# EasyEDA Pro project 2022-4T-MNT-4.eprj

# Schematic EDA4.2
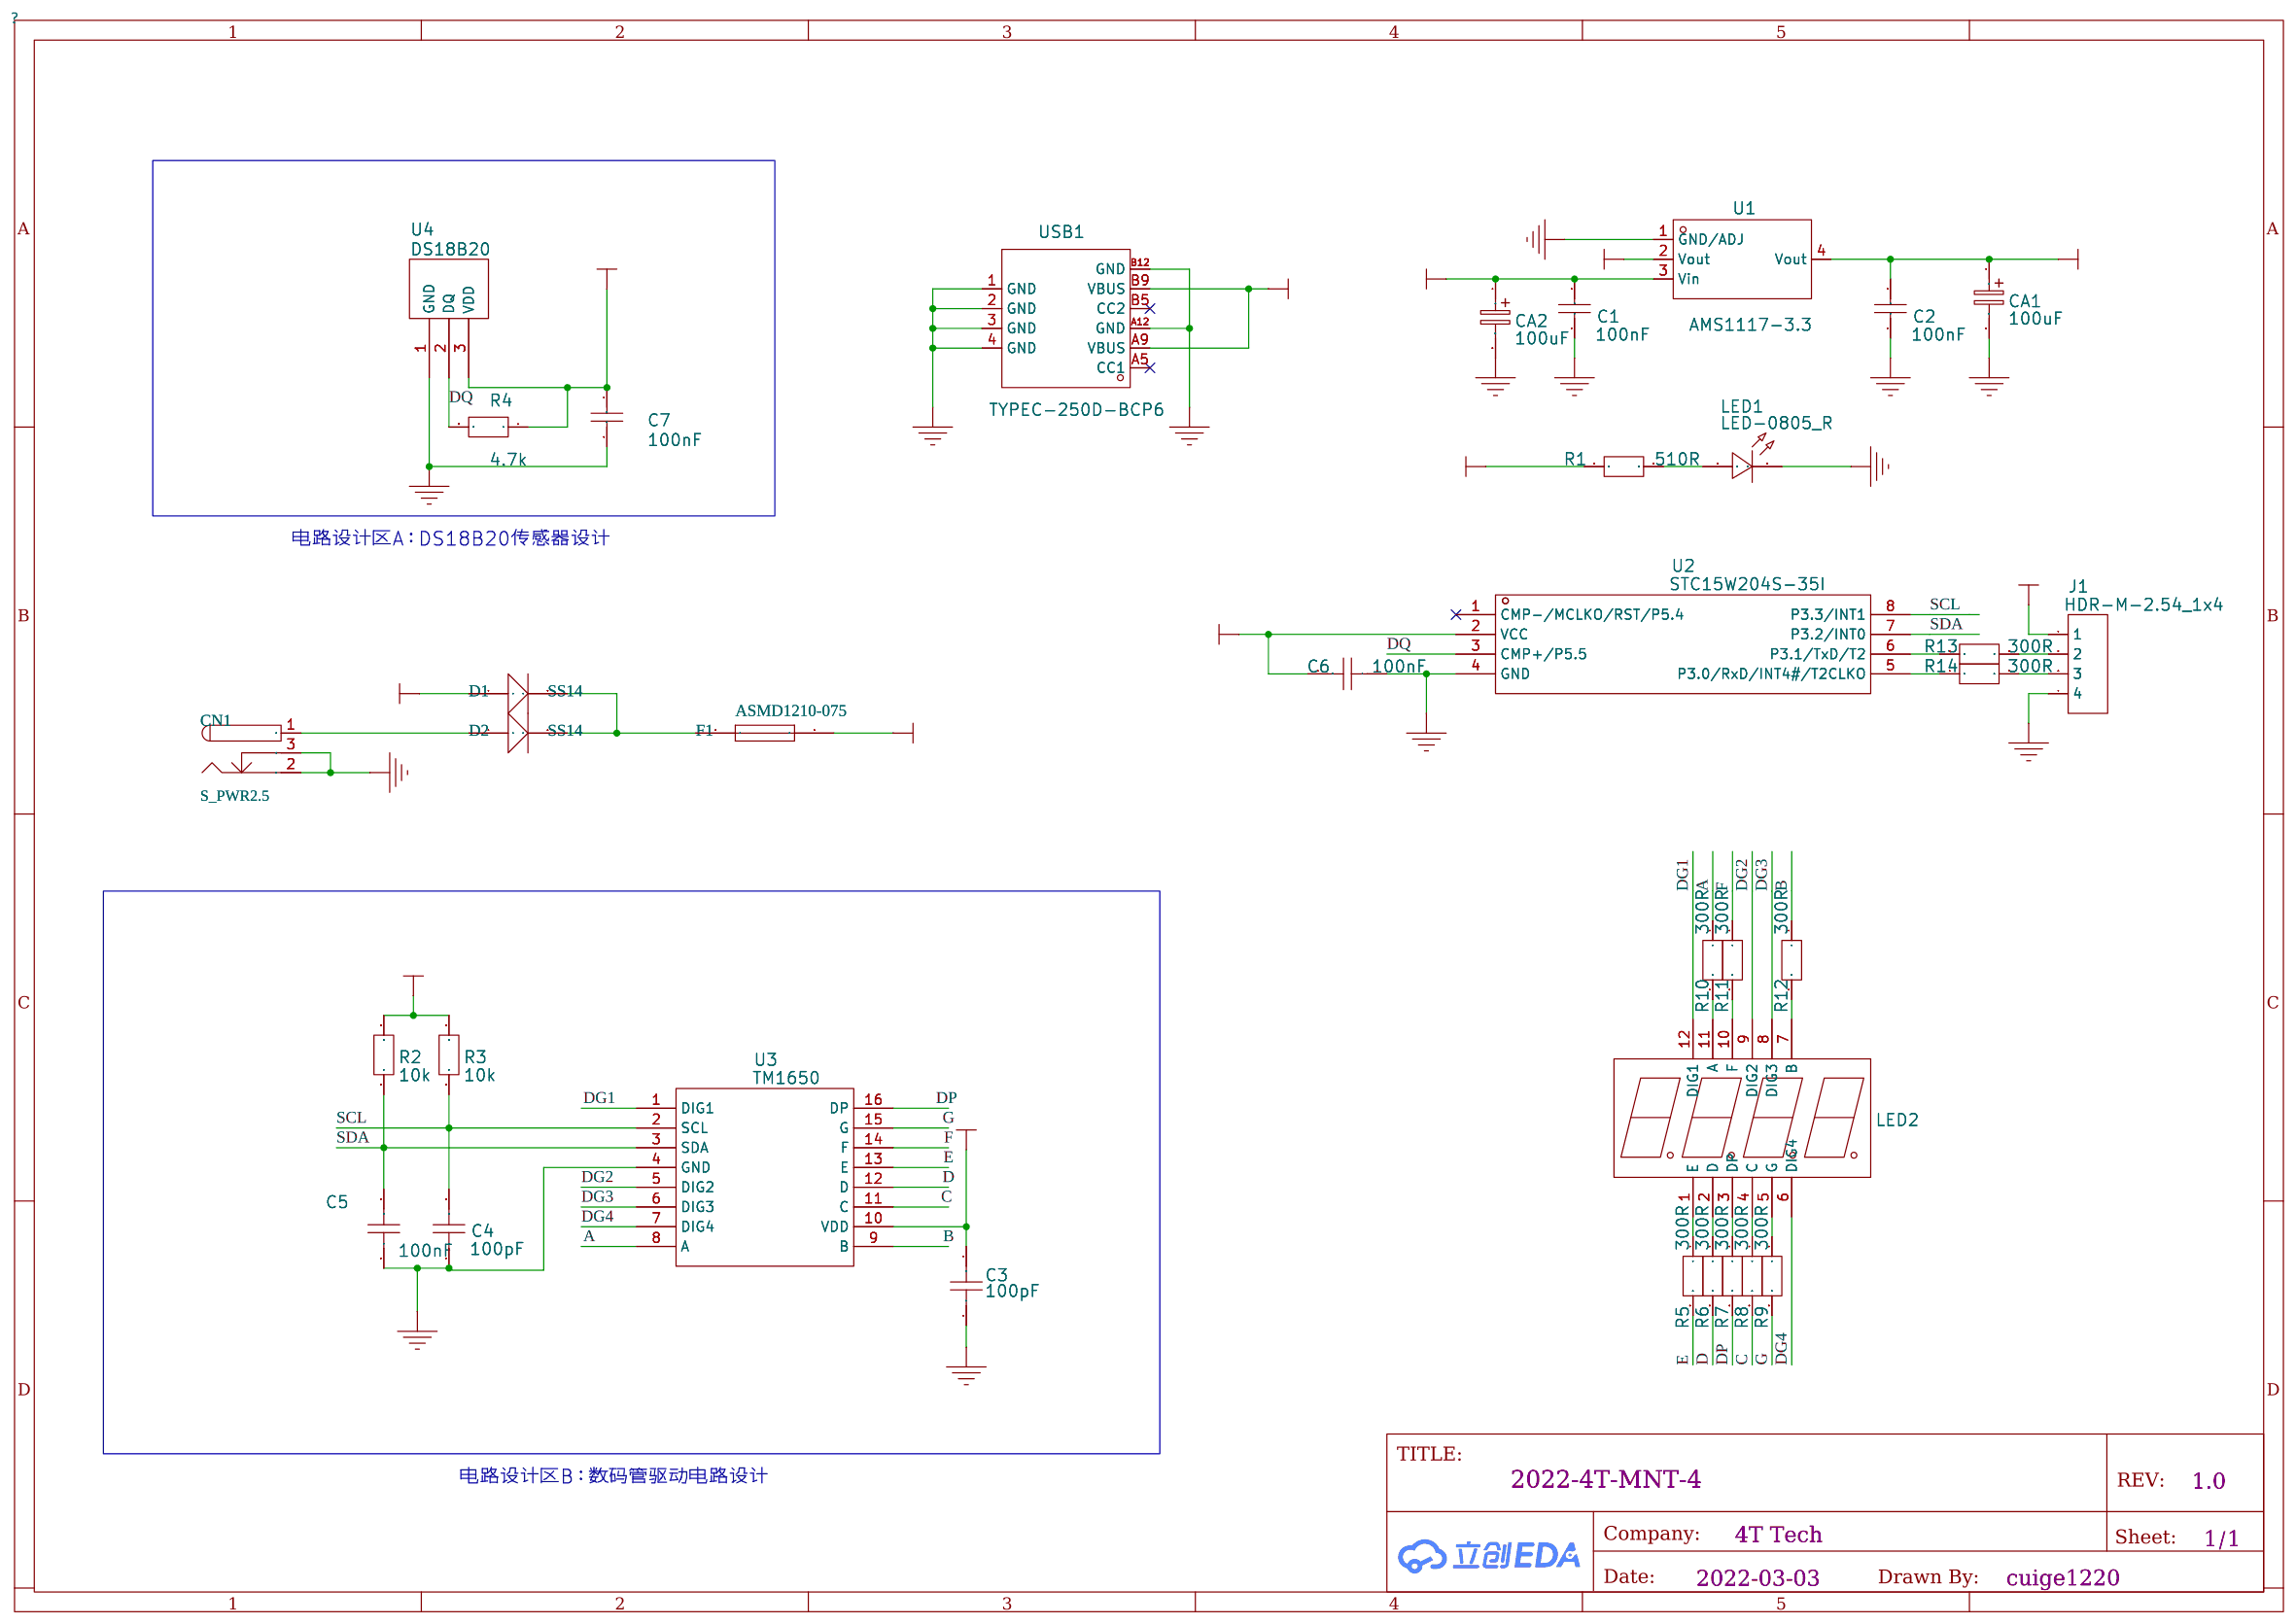
[diagram p0: schematic sheet]

## Parts
C1  100nF  [C0805]
C2  100nF  [C0805]
C3  100pF  [C0805]
C4  100pF  [C0805]
C5  100nF  [C0805]
C6  100nF  [C0805]
C7  100nF  [C0805]
CA1  100uF  [C_CAP-6*H]
CA2  100uF  [C_CAP-6*H]
CN1  S_PWR2.5  [PWR2.5]
D1  SS14  [D_DIO-SMA]
D2  SS14  [D_DIO-SMA]
F1  ASMD1210-075  [R_R1210]
J1  HDR-M-2.54_1x4  [HDR-M-2.54_1X4]
LED1  LED-0805_R  [LED0805_RED]
LED2  DSP  [LED-SEG-TH_12P-L30.0-W14.0-P2.54-S10.16-BL]
R1  510R  [R0805]
R2  10k  [R0805]
R3  10k  [R0805]
R4  4.7k  [R0805]
R5  300R  [R0805]
R6  300R  [R0805]
R7  300R  [R0805]
R8  300R  [R0805]
R9  300R  [R0805]
R10  300R  [R0805]
R11  300R  [R0805]
R12  300R  [R0805]
R13  300R  [R0805]
R14  300R  [R0805]
U1  AMS1117-3.3  [SOP-SOT-223]
U2  STC15W204S-35I  [SOP-8_L4.9-W3.9-P1.27-LS6.0-BL]
U3  TM1650  [SOIC-16_L9.9-W3.9-P1.27-LS6.0-BL]
U4  DS18B20  [DS18B20]
USB1  TYPEC-250D-BCP6  [USB-C-SMD_TYPEC-250D-BCP6]

## Library data of the parts
C1 C2 C7 = 0805F104M500NT: Supplier: LCSC; Manufacturer: FH; Supplier Part: C28378
C3 C4 = 100pF
C5 C6 = 100nF
CA1 CA2 = 100uF
CN1 = S_PWR2.5
D1 D2 = SS14: Published: 8-Jun-2000; LatestRevisionDate: 17-Jul-2002; LatestRevisionNote: Re-released for DXP Platform.; PackageVersion: Sep-1996; PackageReference: SMC; Publisher: Altium Limited; PackageDescription: DO-214-AB/SMC; 2 C-Bend Leads; Body 7.9 x 5.9 mm, inc. leads (LxW); Code_JEDEC: DO-214-AB
F1 = ASMD1210-075: Published: 8-Jun-2000; LatestRevisionDate: 17-Jul-2002; LatestRevisionNote: Re-released for DXP Platform.; PackageReference: PIN-W2/E2.8; Publisher: Altium Limited; PackageDescription: Thru-Hole; 2 Leads
J1 = HDR-M-2.54_1x4: Supplier Part: C124378; Supplier: LCSC
LED1 = 17-21SURC/S530-A3/TR8: Manufacturer: EVERLIGHT(台湾亿光); Supplier Part: C72037
LED2 = SR420361N: Supplier: LCSC; Supplier Part: C98926; Manufacturer: Wuxi ARK Tech Elec
R1 = 510R
R2 R3 = 10k
R4 = 4.7k
R5-R14 = 300R
U1 = AMS1117-3.3: Supplier: LCSC; Manufacturer: AMS; image: //image.lceda.cn/szlcsc/C6186.jpg; Supplier Part: C6186; JLCPCB Part Class: Basic; JLCPCB SMD: Yes
U2 = STC15W204S-35I: Supplier: LCSC; Manufacturer: STC; image: //image.lceda.cn/szlcsc/C42240.jpg; Supplier Part: C42240; JLCPCB Part Class: Extend; JLCPCB SMD: Yes
U3 = TM1650: Supplier: LCSC; Manufacturer: TM; image: //image.lceda.cn/szlcsc/C44444.jpg; Supplier Part: C44444; JLCPCB Part Class: Extend; JLCPCB SMD: Yes
U4 = DS18B20
USB1 = TYPEC-250D-BCP6: Supplier: LCSC; Supplier Part: C720626; Manufacturer: XUNPU; JLCPCB Part Class: Extended Part

## Nets
+5V0: C1.2 CA2.1 F1.2 U1.3(Vin)
GND: C1.1 C2.1 C3.2 C4.1 C5.1 C6.1 C7.2 CA1.2 CA2.2 CN1.2 CN1.3 J1.4 LED1.2 U1.1(GND/ADJ) U2.4(GND) U3.4(GND) U4.1(GND) USB1.1(GND) USB1.2(GND) USB1.3(GND) USB1.4(GND) USB1.A12(GND) USB1.B12(GND)
VDD: C2.2 C3.1 C6.2 C7.1 CA1.1 J1.1 R1.1 R2.2 R3.2 R4.1 U1.2(Vout) U1.4(Vout) U2.2(VCC) U3.10(VDD) U4.3(VDD)
A: R10.1 U3.8(A)
B: R12.1 U3.9(B)
C: R8.2 U3.11(C)
D: R6.2 U3.12(D)
DG1: LED2.12(DIG1) U3.1(DIG1)
DG2: LED2.9(DIG2) U3.5(DIG2)
DG3: LED2.8(DIG3) U3.6(DIG3)
DG4: LED2.6(DIG4) U3.7(DIG4)
DP: R7.2 U3.16(DP)
DQ: R4.2 U2.3(CMP+/P5.5) U4.2(DQ)
E: R5.2 U3.13(E)
F: R11.1 U3.14(F)
G: R9.2 U3.15(G)
SCL: C4.2 R3.1 U2.8(P3.3/INT1) U3.2(SCL)
SDA: C5.2 R2.1 U2.7(P3.2/INT0) U3.3(SDA)
VUSB: D1.1(A) USB1.A9(VBUS) USB1.B9(VBUS)
$1N184: CN1.1 D2.1(A)
$1N185: D1.2(K) D2.2(K) F1.1
$1N294: LED1.1 R1.2
$1N413: LED2.1(E) R5.1
$1N427: LED2.2(D) R6.1
$1N437: LED2.3(DP) R7.1
$1N449: LED2.4(C) R8.1
$1N461: LED2.5(G) R9.1
$1N475: LED2.11(A) R10.2
$1N487: LED2.10(F) R11.2
$1N499: LED2.7(B) R12.2
$1N533: R13.1 U2.6(P3.1/TxD/T2)
$1N534: J1.2 R13.2
$1N535: R14.1 U2.5(P3.0/RxD/INT4#/T2CLKO)
$1N536: J1.3 R14.2

Not connected (* = marked no-connect by the designer): U2 1(CMP-/MCLKO/RST/P5.4)*; USB1 A5(CC1)* B5(CC2)*

## Notes on the sheet
- 电路设计区A：DS18B20传感器设计
- 电路设计区B：数码管驱动电路设计

# Board PCB4
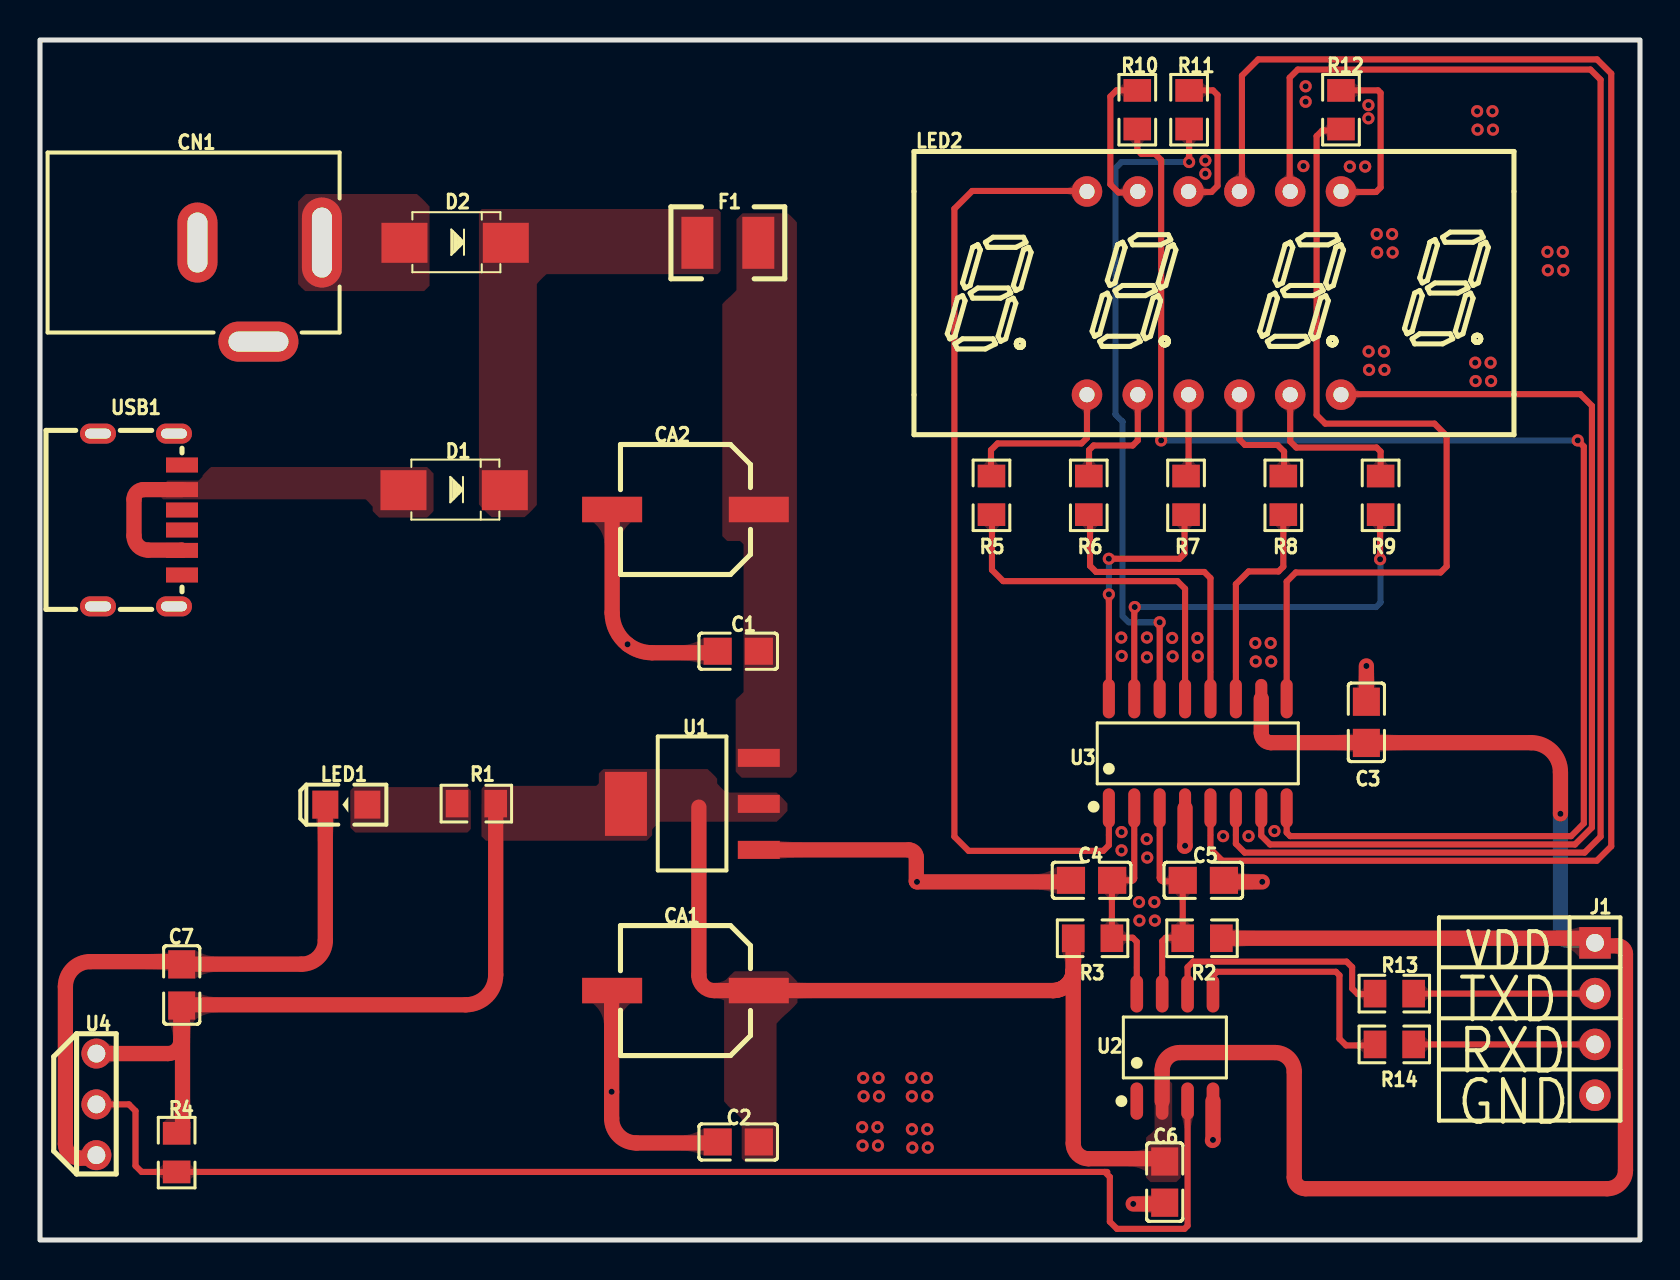
[diagram p1: board, top side]
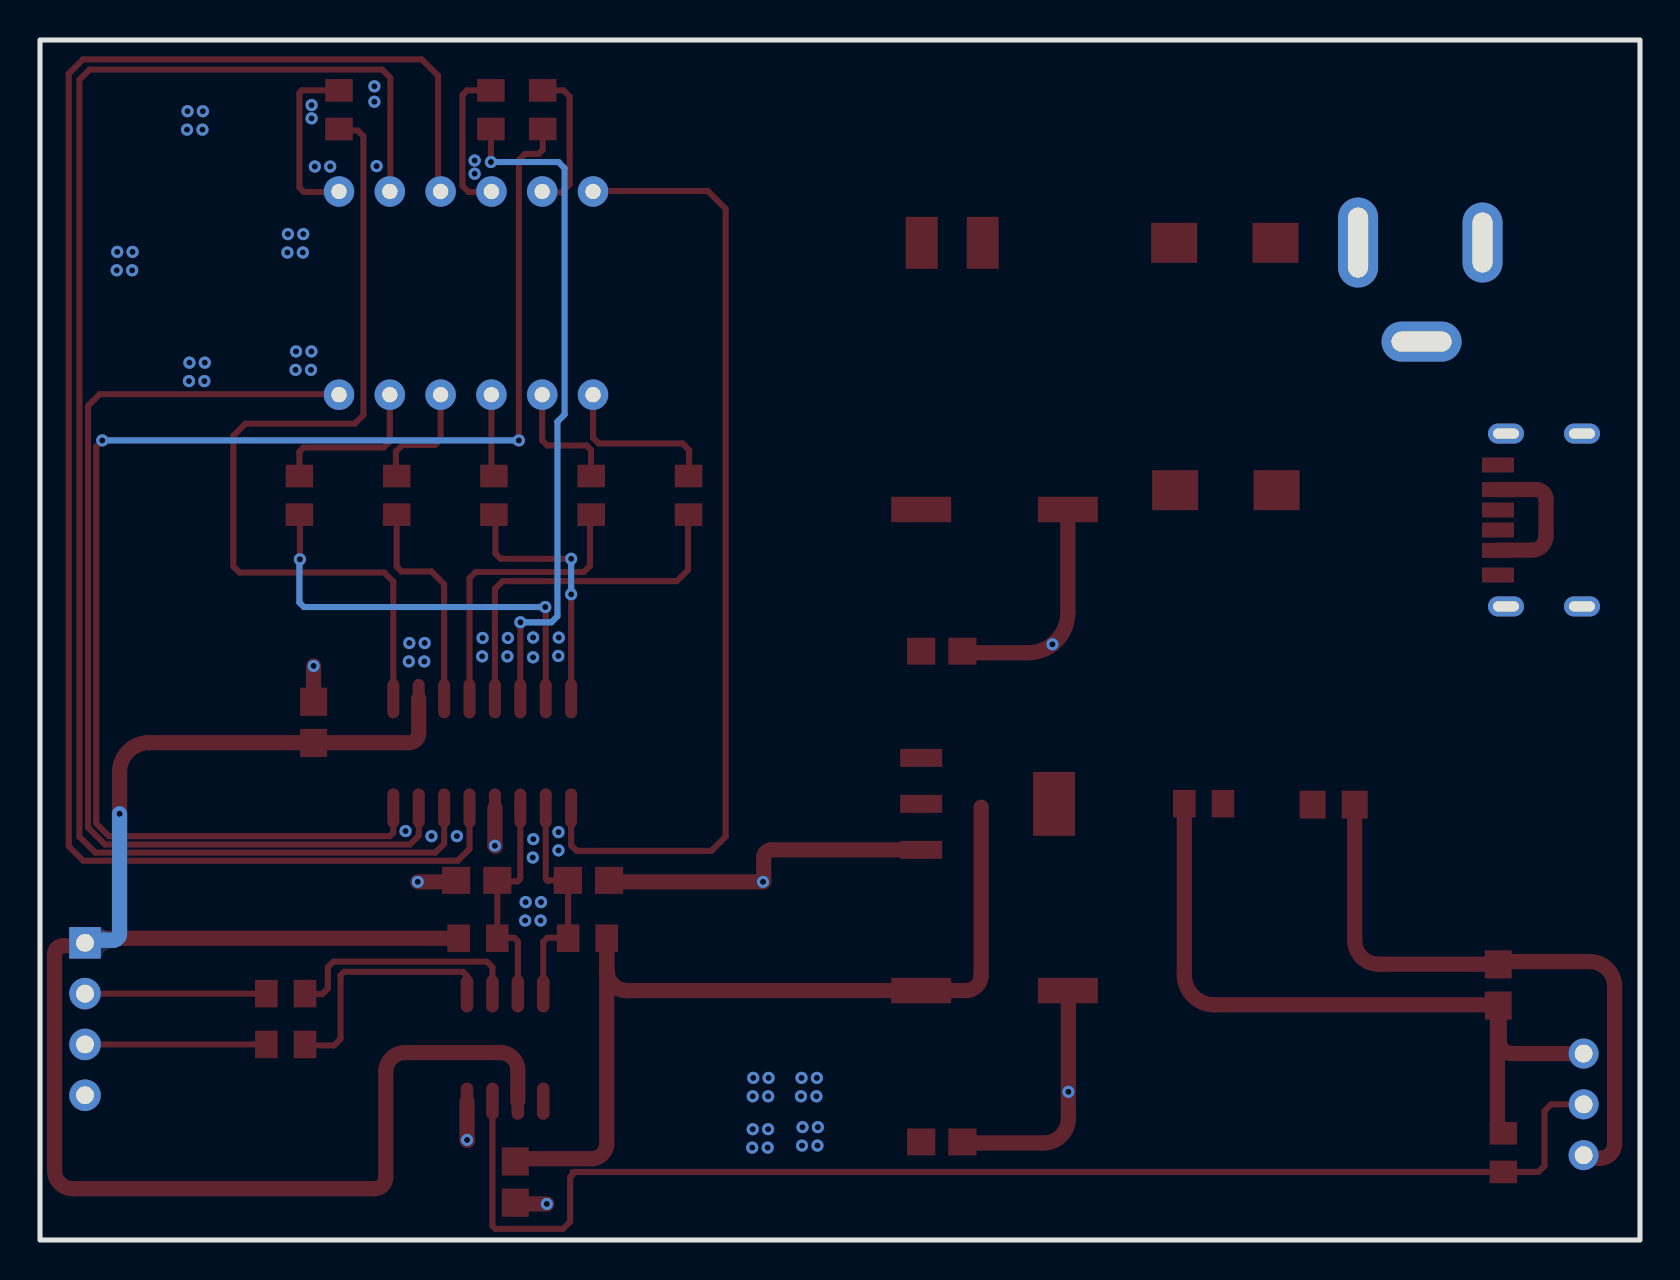
[diagram p2: board, bottom side, seen from below]

Outline 80 x 60 mm; copper layers: Top Layer, Bottom Layer. Coordinates in mm from the lower left corner of the outline.
Outline path: rectangle 0,60 80,0
Stack: Top Layer 0.035mm / Dielectric1 1.51mm FR4 er 4.5 / Bottom Layer 0.035mm

## Design rules (mm)
template: 自定义配置
spacing copperThickness1oz (default): track to track 0.102, other pairs 0.152 to 0.3
spacing copperThickness2oz: track to track 0.203, other pairs 0.152 to 0.3
track width copperThickness1oz (default): min 0.254, default 0.305, max 2.54
track width copperThickness2oz: min 0.203, default 0.254, max 2.54
track width PWR: min 0.254, default 0.762, max 2.54
differential pair differentialPair (default): width min 0.127, default 0.254, max 2.54; gap min 0.152, default 0.152
via viaSize (default): diameter min 0.5, default 0.61, max 10; hole min 0.3, default 0.305, max 6.299
net GND uses PWR
net VUSB uses PWR
net VDD uses PWR
net +5V0 uses PWR

## Placement (name value [footprint] x y rotation side)
C1  100nF  [C0805]  34.91 29.44 0 top
C2  100nF  [C0805]  34.91 4.9 0 top
C3  100pF  [C0805]  66.32 25.88 90 top
C4  100pF  [C0805]  52.58 17.98 0 top
C5  100nF  [C0805]  58.17 17.98 180 top
C6  100nF  [C0805]  56.24 2.9 90 top
C7  100nF  [C0805]  7.09 12.75 90 top
CA1  100uF  [C_CAP-6*H]  35.94 12.47 180 top
CA2  100uF  [C_CAP-6*H]  35.94 36.53 180 top
CN1  S_PWR2.5  [PWR2.5]  8 50 0 top
D1  SS14  [D_DIO-SMA]  18.16 37.49 0 top
D2  SS14  [D_DIO-SMA]  18.21 49.86 0 top
F1  ASMD1210-075  [R_R1210]  32.87 49.86 0 top
J1  HDR-M-2.54_1x4  [HDR-M-2.54_1X4]  77.75 11.05 270 top
LED1  LED-0805_R  [LED0805_RED]  15.32 21.77 180 top
LED2  DSP  [LED-SEG-TH_12P-L30.0-W14.0-P2.54-S10.16-BL]  58.7 47.35 0 top
R1  510R  [R0805]  21.82 21.82 180 top
R2  10k  [R0805]  58.1 15.09 0 top
R3  10k  [R0805]  52.63 15.09 180 top
R4  4.7k  [R0805]  6.83 4.37 270 top
R5  300R  [R0805]  47.57 37.23 270 top
R6  300R  [R0805]  52.44 37.23 270 top
R7  300R  [R0805]  57.3 37.23 270 top
R8  300R  [R0805]  62.17 37.23 270 top
R9  300R  [R0805]  67.03 37.23 270 top
R10  300R  [R0805]  54.86 56.52 90 top
R11  300R  [R0805]  57.46 56.52 90 top
R12  300R  [R0805]  65.05 56.52 90 top
R13  300R  [R0805]  67.72 12.32 0 top
R14  300R  [R0805]  67.72 9.78 0 top
U1  AMS1117-3.3  [SOP-SOT-223]  35.94 19.51 180 top
U2  STC15W204S-35I  [SOP-8_L4.9-W3.9-P1.27-LS6.0-BL]  56.74 9.63 0 top
U3  TM1650  [SOIC-16_L9.9-W3.9-P1.27-LS6.0-BL]  57.89 24.33 0 top
U4  -  [DS18B20]  2.82 4.24 90 top
USB1  TYPEC-250D-BCP6  [USB-C-SMD_TYPEC-250D-BCP6]  5 36 270 top

## Footprints (pads in the part's own frame, mm; a bottom-side part is the same pattern mirrored in y, then rotated)
C0805
  rect 1.41x1.35 smd: 1(-1.03,0) 2(1.03,0)
C_CAP-6*H
  rect 3x1.274 smd: 1(0,0) 2(7.334,0)
D_DIO-SMA
  rect 2.3x2 smd: 1(0.01,0) 2(5.08,0)
DS18B20
  round 1.5 hole 0.894x0.889: 1(0,0) 2(2.54,0) 3(5.08,0)
HDR-M-2.54_1X4
  rect 1.575x1.575 hole 0.889: 1(-3.81,0)
  round 1.575 hole 0.889: 2(-1.27,0) 3(1.27,0) 4(3.81,0)
LED0805_RED
  rect 1.3x1.399 smd: 1(-1.05,0) 2(1.05,0)
LED-SEG-TH_12P-L30.0-W14.0-P2.54-S10.16-BL
  round 1.524 hole 0.762: 1(-6.35,-5.08) 2(-3.81,-5.08) 3(-1.27,-5.08) 4(1.27,-5.08) 5(3.81,-5.08) 6(6.35,-5.08) 7(6.35,5.08) 8(3.81,5.08) 9(1.27,5.08) 10(-1.27,5.08) 11(-3.81,5.08) 12(-6.35,5.08)
PWR2.5
  oval 2x4.5 hole 1x3.5: 1(6.096,-0.127)
  oval 2x4 hole 1x3: 2(-0.127,-0.127)
  oval 4x2 hole 3x1: 3(2.921,-5.08)
R0805
  rect 1.133x1.377 smd: 1(-0.966,0) 2(0.966,0)
R_R1210
  rect 1.6x2.6 smd: 1(0,0) 2(3.048,0)
SOIC-16_L9.9-W3.9-P1.27-LS6.0-BL
  oval 0.602x1.971 smd: 1(-4.445,-2.736) 2(-3.175,-2.736) 3(-1.905,-2.736) 4(-0.635,-2.736) 5(0.635,-2.736) 6(1.905,-2.736) 7(3.175,-2.736) 8(4.445,-2.736) 9(4.445,2.736) 10(3.175,2.736) 11(1.905,2.736) 12(0.635,2.736) 13(-0.635,2.736) 14(-1.905,2.736) 15(-3.175,2.736) 16(-4.445,2.736)
SOP-8_L4.9-W3.9-P1.27-LS6.0-BL
  oval 0.63x1.865 smd: 1(-1.905,-2.683) 2(-0.635,-2.683) 3(0.635,-2.683) 4(1.905,-2.683) 5(1.905,2.683) 6(0.635,2.683) 7(-0.635,2.683) 8(-1.905,2.683)
SOP-SOT-223
  rect 2.1x0.9 smd: 1(0,0) 2(0,-2.3) 3(0,-4.6)
  rect 2.1x3.2 smd: 4(6.644,-2.3)
USB-C-SMD_TYPEC-250D-BCP6
  oval 1x1.8 hole 0.5x1.3: 1(-4.32,1.7) 2(-4.32,-2.1) 3(4.32,-2.1) 4(4.32,1.7)
  rect 0.75x1.6 smd: A5(-0.5,2.1) A9(1.52,2.1) A12(2.75,2.1) B5(0.5,2.1) B9(-1.52,2.1) B12(-2.75,2.1)

## Nets
As in the schematic.

Pads without a net: U2 1; USB1 A5 B5

## Via types
v1: diameter 0.61, hole 0.305, Top Layer to Bottom Layer, 85 vias

## Routing (per net, layer and track width the routed paths; a pad name or vN(x,y) marks a point on that pad's centre or on a via; arc(x,y) is an arc through that point)
GND: length 81.2
  Top Layer w0.762: C3.2 v1(66.32,28.7) ; v1(61.11,17.91) 59.27,17.91 arc(59.22,17.93) C5.1 ; U3.4 v1(57.25,19.71) arc(57.25,19.69) 57.23,19.69 ; 28.58,12.45 v1(28.58,7.41) 28.58,6.09 arc(28.94,5.21) 29.82,4.85 33.83,4.85 arc(33.87,4.87) C2.1 ; v1(54.66,1.8) 56.17,1.8 arc(56.22,1.82) C6.1 ; CA2.2 28.61,31.36 arc(28.81,30.48) v1(29.38,29.78) arc(29.96,29.47) 30.61,29.36 33.81,29.36 arc(33.86,29.38) C1.1 ; U2.4 v1(58.65,5) arc(58.64,4.99) 58.62,4.98 ; 6.88,13.92 2.51,13.92 arc(1.63,13.55) 1.27,12.67 1.27,4.8 arc(1.48,4.3) 1.98,4.09 2.67,4.09 arc(2.77,4.13) U4.1 ; U1.1 43.43,19.51 arc(43.7,19.4) 43.81,19.13 43.81,17.94 arc(43.82,17.92) v1(43.85,17.91) 51.47,17.91 arc(51.53,17.93) C4.1 ; LED1.2 14.27,14.98 arc(13.92,14.14) 13.08,13.79 7.1,13.79 arc(7.09,13.79) C7.2
  vias: v1(41.11,5.64) v1(41.13,4.72) v1(41.16,8.11) v1(41.18,7.19) v1(41.93,8.11) v1(41.87,5.64) v1(41.9,4.72) v1(41.95,7.19) v1(43.57,8.11) v1(43.59,7.19) v1(43.6,5.54) v1(43.62,4.62) v1(44.34,8.11) v1(44.36,7.19) v1(44.36,5.54) v1(44.39,4.62) v1(54.06,30.12) v1(54.08,29.2) v1(54.08,20.4) v1(54.08,19.48) v1(54.95,16.89) v1(54.97,15.97) v1(55.35,30.12) v1(55.35,29.13) v1(55.34,20.04) v1(55.36,19.12) v1(55.72,16.89) v1(55.74,15.97) v1(56.61,30.1) v1(56.63,29.18) v1(57.87,30.1) v1(57.89,29.18) v1(58.27,53.98) v1(58.27,53.31) v1(59.16,20.19) v1(60.43,20.19) v1(60.77,29.85) v1(60.79,28.93) v1(61.53,29.85) v1(61.56,28.93) v1(61.72,20.45) v1(63.17,53.7) v1(63.28,57.69) v1(63.28,56.91) v1(65.49,53.67) v1(66.26,53.67) v1(66.42,56.74) v1(66.42,56.08) v1(66.43,44.43) v1(66.45,43.51) v1(66.84,50.3) v1(66.86,49.37) v1(67.2,44.43) v1(67.22,43.51) v1(67.6,50.3) v1(67.63,49.37) v1(71.76,43.87) v1(71.78,42.95) v1(71.86,56.44) v1(71.88,55.52) v1(72.53,43.87) v1(72.62,56.44) v1(72.65,55.52) v1(72.55,42.95) v1(75.37,49.41) v1(75.39,48.49) v1(76.14,49.41) v1(76.16,48.49)
VDD: length 178.3
  Top Layer w0.762: 7.13,11.76 7.13,5.63 arc(7.04,5.42) R4.1 ; 7.13,11.76 21.28,11.76 arc(22.35,12.2) 22.78,13.26 R1.1 ; 7.13,11.76 arc(7.1,11.75) C7.1 arc(7.05,11.71) 7.04,11.67 7.04,9.96 arc(6.85,9.51) 6.4,9.32 U4.3 ; R2.2 77.85,15.09 arc(78.01,15.02) 78.08,14.86 ; 50.65,12.47 CA1.1 33.71,12.47 arc(33.17,12.69) 32.94,13.23 32.94,21.64 ; 50.65,12.47 arc(51.35,12.75) 51.66,13.44 ; 50.65,12.47 arc(51.35,12.75) 51.66,13.44 ; 50.65,12.47 arc(51.35,12.75) 51.66,13.44 ; v1(76.02,21.31) 76.02,23.39 arc(75.59,24.44) 74.55,24.87 66.31,24.87 ; 51.66,13.44 51.66,4.83 arc(51.89,4.29) 52.43,4.06 56.1,4.06 arc(56.19,4.02) C6.2 ; 51.66,13.44 R3.2 ; 51.66,13.44 arc(51.66,13.46) 51.66,13.49 ; 51.66,13.44 arc(51.66,13.46) 51.66,13.49 ; 51.66,13.44 arc(51.66,13.46) 51.66,13.49 ; U2.2 56.11,8.48 arc(56.37,9.11) 57,9.37 61.75,9.37 arc(62.43,9.09) 62.71,8.41 62.71,3.12 arc(62.88,2.73) 63.27,2.57 78.36,2.57 arc(79.01,2.83) 79.27,3.48 79.27,14.3 arc(79.15,14.59) 78.87,14.71 77.9,14.71 arc(77.79,14.75) J1.1 ; 51.66,13.49 51.66,15.09 ; U3.10 61.06,25.35 arc(61.2,25.01) 61.54,24.87 66.31,24.87 ; 66.31,24.87 arc(66.32,24.86) C3.1
  Bottom Layer w0.762: v1(76.02,21.31) 76.02,15.32 arc(76.12,15.08) 76.35,14.99 77.95,14.99 arc(78.04,14.95) 78.08,14.86
A: length 73
  Top Layer w0.305: v1(56.06,39.98) 56.06,54 55.75,54.31 55.07,54.31 54.86,54.51 R10.1 ; v1(76.89,39.98) 77.19,39.68 77.19,20.83 76.56,20.19 62.51,20.19 62.33,20.37 U3.8
  Bottom Layer w0.305: v1(76.89,39.98) v1(56.06,39.98)
B: length 42.9
  Top Layer w0.305: R12.1 64.97,55.47 64.11,55.47 63.83,55.19 63.83,41.25 64.26,40.82 69.72,40.82 70.33,40.21 70.33,33.68 70.03,33.38 62.79,33.38 62.33,32.92 U3.9
C: length 11.1
  Top Layer w0.305: U3.11 59.79,32.79 60.43,33.43 61.93,33.43 62.17,33.67 R8.2
D: length 14.9
  Top Layer w0.305: U3.12 58.52,33.09 58.22,33.4 52.81,33.4 52.5,33.71 52.5,36.2 R6.2
DG1: length 48.4
  Top Layer w0.305: LED2.12 52.32,52.45 46.61,52.45 45.72,51.56 45.72,20.17 46.43,19.46 53.16,19.46 53.44,19.74 U3.1
DG2: length 86.2
  Top Layer w0.305: U3.5 58.52,19.56 59.12,18.96 77.84,18.96 78.56,19.69 78.56,58.32 77.85,59.03 60.91,59.03 60.1,58.22 60.1,52.55 LED2.9
DG3: length 80
  Top Layer w0.305: LED2.8 62.48,52.45 62.48,58.12 62.89,58.52 77.52,58.52 78.03,58.01 78.03,20.17 77.23,19.37 60.23,19.37 59.79,19.81 U3.6
DG4: length 52.3
  Top Layer w0.305: U3.7 61.06,20.22 61.5,19.78 76.75,19.78 77.6,20.62 77.6,41.71 77.01,42.29 65.07,42.29 LED2.6
DP: length 12.9
  Top Layer w0.305: v1(53.44,34.06) 56.97,34.06 57.23,34.32 57.23,36.19 R7.2 ; U3.16 v1(53.44,32.28)
  Bottom Layer w0.305: v1(53.44,32.28) 53.44,34.06
DQ: length 66.5
  Top Layer w0.305: 53.24,3.4 R4.2 5.08,3.4 4.78,3.71 4.78,6.45 4.44,6.78 U4.2 ; 53.24,3.4 53.49,3.15 53.49,0.91 53.85,0.56 57.23,0.56 57.38,0.71 57.38,6.92 57.35,6.94 ; 53.24,3.4 53.37,3.4
E: length 18.3
  Top Layer w0.305: U3.13 57.25,32.56 56.87,32.94 48.16,32.94 47.6,33.5 47.6,36.24 R5.2
F: length 33.8
  Top Layer w0.305: U3.14 55.98,30.88 ; v1(57.46,53.9) R11.1
  Bottom Layer w0.305: v1(57.46,53.9) 54.08,53.9 53.77,53.59 53.77,41.28 54.13,40.92 54.13,31.19 54.43,30.89 v1(55.98,30.89)
G: length 21.4
  Top Layer w0.305: U3.15 54.71,31.62 v1(54.74,31.65) ; v1(67,34.04) 67,36.24 R9.2
  Bottom Layer w0.305: v1(67,34.04) 67.03,34.01 67.03,31.88 66.8,31.65 v1(54.74,31.65)
SCL: length 11.5
  Top Layer w0.305: U3.2 54.71,18.09 arc(54.68,18) 54.58,17.96 arc(54.58,17.98) 54.56,17.98 C4.2 arc(53.6,17.98) 53.59,17.97 R3.1 53.62,15.11 54.64,15.11 54.84,14.91 U2.8
SDA: length 11.4
  Top Layer w0.305: U3.3 55.98,18.11 arc(56.04,17.98) 56.16,17.93 57.09,17.93 arc(57.12,17.95) C5.2 R2.1 57.11,15.11 56.29,15.11 56.11,14.94 U2.7
VUSB: length 7.3
  Top Layer w0.762: 7.1,37.52 5.19,37.52 arc(4.84,37.38) 4.7,37.03 4.7,35.2 arc(4.91,34.7) 5.41,34.49 7.09,34.49 arc(7.1,34.49) USB1.A9
$1N413: length 8.5
  Top Layer w0.305: LED2.1 52.35,40.11 52.07,39.83 47.88,39.83 47.55,39.5 47.55,38.23 R5.1
$1N427: length 6.2
  Top Layer w0.305: R6.1 52.45,38.21 52.45,39.5 52.68,39.73 54.64,39.73 54.89,39.98 LED2.2
$1N437: length 4.1
  Top Layer w0.305: LED2.3 57.43,38.33 R7.1
$1N449: length 6
  Top Layer w0.305: R8.1 62.2,38.24 62.2,39.42 61.87,39.75 60.25,39.75 59.97,40.03 LED2.4
$1N461: length 8.3
  Top Layer w0.305: R9.1 67.03,39.42 66.83,39.62 62.81,39.62 62.51,39.93 LED2.5
$1N475: length 7.4
  Top Layer w0.305: R10.2 53.82,57.48 53.52,57.18 53.52,52.78 53.92,52.38 54.84,52.38 LED2.11
$1N487: length 7.6
  Top Layer w0.305: LED2.10 57.46,52.4 58.57,52.4 58.88,52.7 58.88,57.25 58.65,57.48 R11.2
$1N499: length 8.8
  Top Layer w0.305: R12.2 66.9,57.48 67.03,57.35 67.03,52.63 66.8,52.4 65.07,52.4 LED2.7
$1N533: length 12.1
  Top Layer w0.305: U2.6 57.38,13.64 57.66,13.92 65.33,13.92 65.61,13.64 65.61,12.57 65.89,12.29 66.72,12.29 R13.1
$1N534: length 9.4
  Top Layer w0.305: R13.2 78.08,12.32
$1N535: length 12.5
  Top Layer w0.305: U2.5 58.65,13.21 58.85,13.41 64.8,13.41 64.97,13.23 64.97,10.06 65.3,9.73 66.7,9.73 R14.1
$1N536: length 9.4
  Top Layer w0.305: R14.2 78.08,9.78

## Copper pours and planes (outline as drawn; the poured copper is in the pictures)
+5V0 on Top Layer: 34.11,51.33 37.85,51.33 37.85,23.11 34.11,23.11
GND on Top Layer: -5.89,67.13 92.13,67.13 92.13,-6.53 -5.89,-6.53
GND on Bottom Layer: -5.89,64.67 85.78,64.67 85.78,-4.37 -5.89,-4.37
VDD on Top Layer: 55.3,7.95 57.04,7.95 57.04,2.9 55.3,2.9
VDD on Top Layer: 22.07,23.55 37.37,23.55 37.37,19.96 22.07,19.96
VDD on Top Layer: 34.2,13.44 37.87,13.44 37.87,3.89 34.2,3.89
VUSB on Top Layer: 6.07,38.65 19.68,38.65 19.68,36.12 6.07,36.12
$1N184 on Top Layer: 12.9,52.3 19.48,52.3 19.48,47.45 12.9,47.45
$1N185 on Top Layer: 21.95,51.55 34.04,51.55 34.04,36.14 21.95,36.14
$1N294 on Top Layer: 15.52,22.65 21.54,22.65 21.54,20.37 15.52,20.37

Small or netless copper shapes (teardrops, artwork), in the pictures only: 100 on Top Layer, 9 on Bottom Layer

## Text on the board
Top Silkscreen Layer: VDD | GND | TXD | RXD
